# EAGLE design Blinds Motor ESP32 w endstops (EAGLE 9.6.2)
AUTHOR: E. Anderson; REV: 1
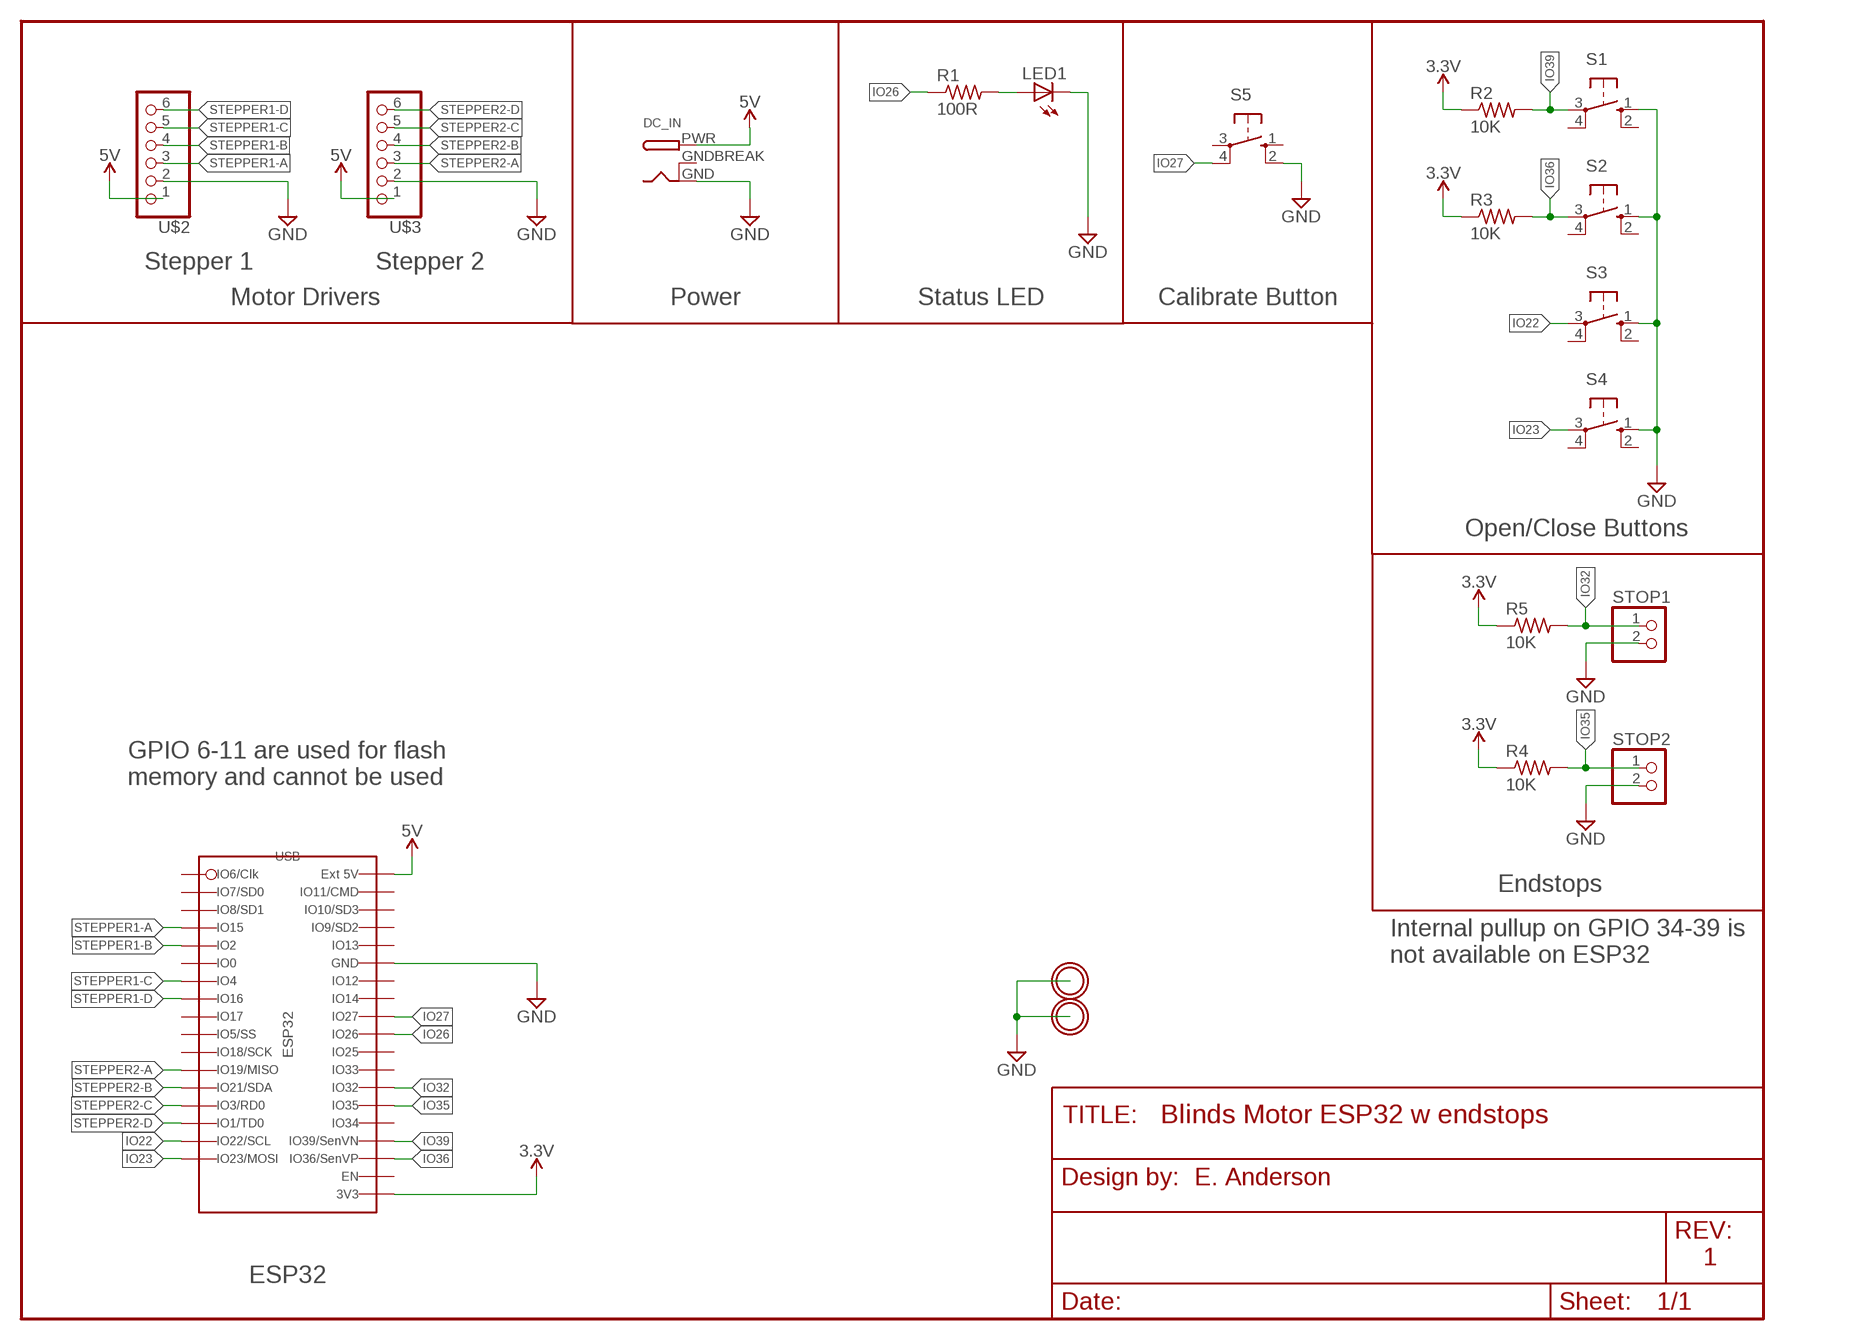
[diagram p0: schematic, sheet 1]

## Parts
DC_IN  DCBARRELPTH  [DCJACK_2MM_PTH]
LED1  LED-CHIPLED_1206_LONG  [CHIPLED_1206_LONG]
R1  100R  R_USR1206  [R1206]
R2  10K  R_USR1206  [R1206]
R3  10K  R_USR1206  [R1206]
R4  10K  R_USR1206  [R1206]
R5  10K  R_USR1206  [R1206]
S1  B3F-10XX  [B3F-10XX]
S2  B3F-10XX  [B3F-10XX]
S3  B3F-10XX  [B3F-10XX]
S4  B3F-10XX  [B3F-10XX]
S5  B3F-10XX  [B3F-10XX]
STOP1  1X2_HEADER_LONG  [1X02]
STOP2  1X2_HEADER_LONG  [1X02]
U$2  Stepper 1  1X6_HEADER_LONG  [1X06]
U$3  Stepper 2  1X6_HEADER_LONG  [1X06]
U$5  MICROBUILDER_MOUNTINGHOLE3.0THIN  [MICROBUILDER_MOUNTINGHOLE_3.0_PLATEDTHIN]
U$6  MICROBUILDER_MOUNTINGHOLE3.0THIN  [MICROBUILDER_MOUNTINGHOLE_3.0_PLATEDTHIN]
U$7  ESP32-DEV  [ESP32_DEV]

## Nets
3.3V: R2.1 R3.1 R4.1 R5.1 U$7.3V3
5V: DC_IN.PWR U$2.1 U$3.1 U$7.5V(EXT_5V)
GND: DC_IN.GND LED1.C S1.1(S) S2.1(S) S3.1(S) S4.1(S) S5.2(S1) STOP1.2 STOP2.2 U$2.2 U$3.2 U$7.GND1 U$7.GND2(GND1) U$7.GND(GND1)
IO22: S3.3(P) U$7.IO22
IO23: S4.3(P) U$7.IO23(IO23/SCL)
IO26: R1.1 U$7.IO26
IO27: S5.4(P1) U$7.IO27
IO32: R5.2 STOP1.1 U$7.IO32
IO35: R4.2 STOP2.1 U$7.IO35
IO36: R3.2 S2.3(P) U$7.IO36-SVP(IO36/SVP)
IO39: R2.2 S1.3(P) U$7.IO39-SVN(IO39/SVN)
N$1: LED1.A R1.2
STEPPER1-A: U$2.3 U$7.IO15
STEPPER1-B: U$2.4 U$7.IO2
STEPPER1-C: U$2.5 U$7.IO4
STEPPER1-D: U$2.6 U$7.IO16
STEPPER2-A: U$3.3 U$7.IO19
STEPPER2-B: U$3.4 U$7.IO21(IO21/SDA)
STEPPER2-C: U$3.5 U$7.IO3-RXD0(RXD0)
STEPPER2-D: U$3.6 U$7.IO1-TXD0(TXD0)
Unconnected: S1.2(S1) S1.4(P1) S2.2(S1) S2.4(P1) S3.2(S1) S3.4(P1) S4.2(S1) S4.4(P1) S5.1(S) S5.3(P) U$7.EN U$7.IO0 U$7.IO5 U$7.IO6-CLK(CLK) U$7.IO7-SD0(SD0) U$7.IO8-SD1(SD1) U$7.IO9-SD2(IO9/SD2) U$7.IO10-SD3(IO10/SD3) U$7.IO11-CMD(IO11/CMD) U$7.IO12 U$7.IO13 U$7.IO14 U$7.IO17 U$7.IO18 U$7.IO25 U$7.IO33 U$7.IO34

## Notes on the sheet
- Stepper 1 | Stepper 2
- Motor Drivers | Power | Status LED | Calibrate Button
- Open/Close Buttons
- GPIO 6-11 are used for flash
  memory and cannot be used
- Endstops
- Internal pullup on GPIO 34-39 is
  not available on ESP32
- ESP32

## Power pins joined to a net without a drawn wire
GNDBREAK: DC_IN.GNDBREAK

## Library data of the parts
DC_IN = connectors:DCBARREL: 2.0mm DC Barrel Jack DCJACK_2MM_PTH - Through Hole Jack (4UConnector: 05537)
LED1 = Transistors MOSFETs:LED: LED White LED 0.1" pitch
R1-R5 = passives:R_US: Resistor 7mm pin spacing
S1-S5 = buttons:B3F-10XX: OMRON SWITCH; MPN: B3F-1000; OC_FARNELL: 176432; OC_NEWARK: 36M3542
STOP1 STOP2 = connectors:1X2_HEADER: 1x2 Pin Header w/ 0.1" spacing. Octagonal pads
U$2 U$3 = connectors:1X6_HEADER: 1x6 Pin Header w/ 0.1" spacing. Octagonal pads
U$5 U$6 = connectors:MICROBUILDER_MOUNTINGHOLE: Mounting Hole For #2 screws (0.086"/2.18mm width, 0.094"/2.4mm hole) use 2.5mm; BOM: EXCLUDE
U$7 = connectors:ESP32: ESP-32-Dev ESP32 from Inland/Microcenter

## Board
Blind stepper motor board with endstops Board for connecting ESP32 to stepper drivers. Uses ESP32-Dev board or the Inland clone sold at Microcenter. Could be modified to use other ESP32 based developer boards, but code would need to be modified to use different pinouts. Uses Keyestudio Stepper ULN2003 based driver
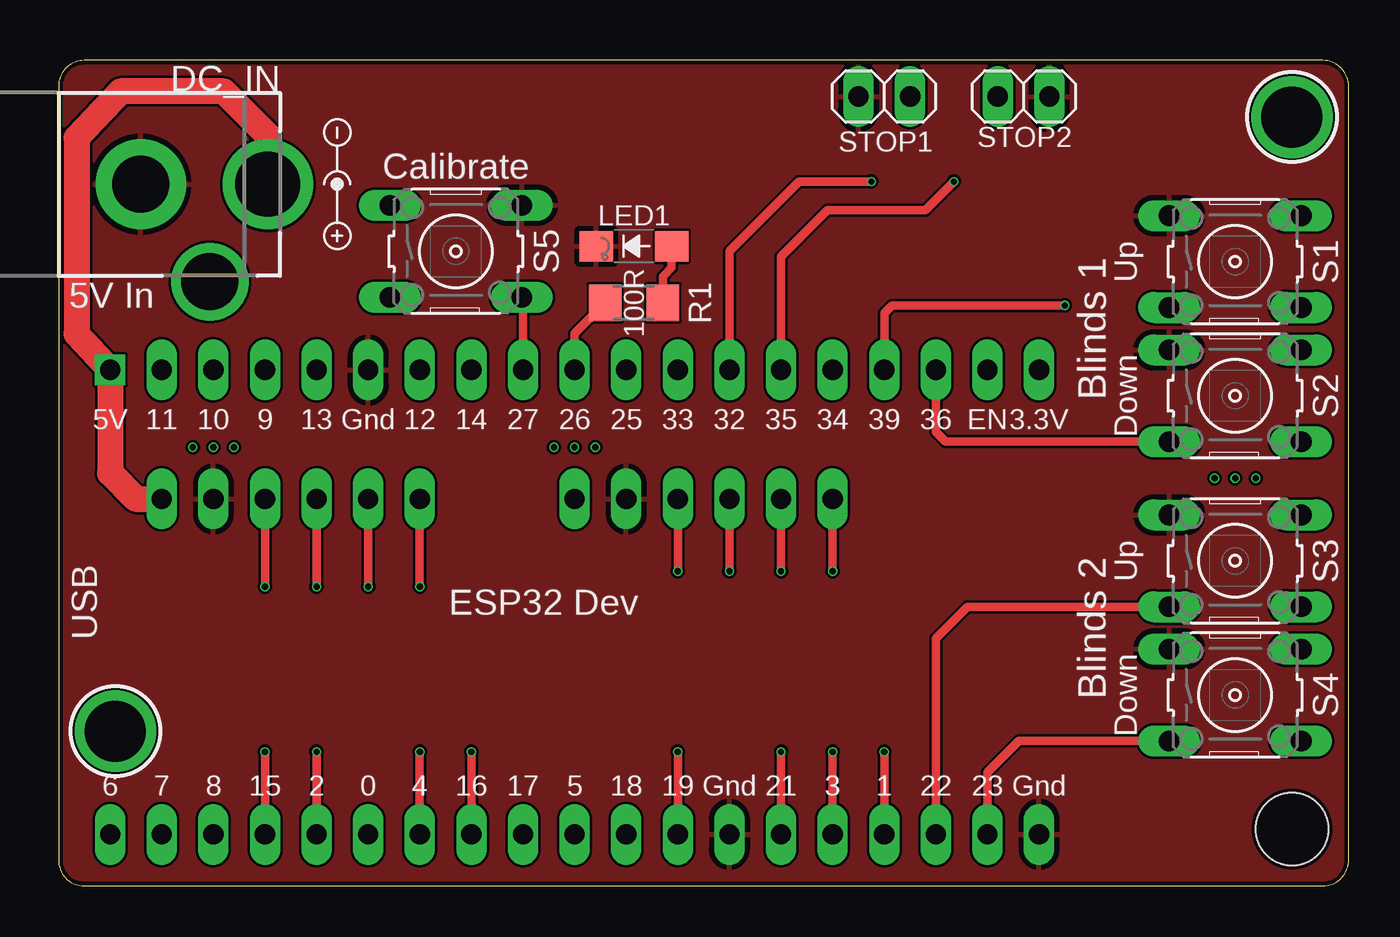
[diagram p1: board, top side]
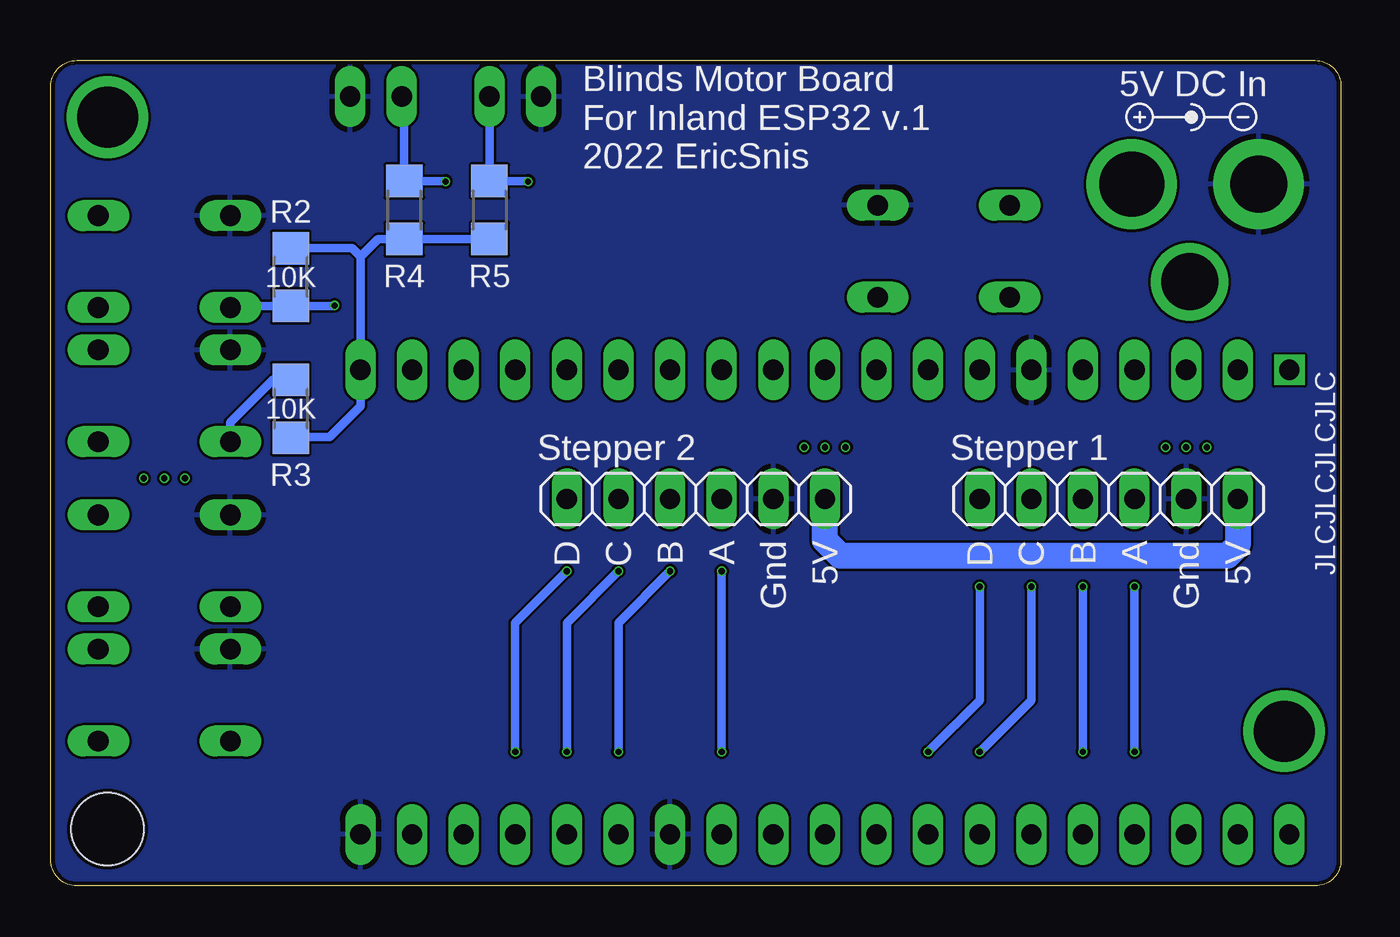
[diagram p2: board, bottom side, seen from below]

Size 63.5 x 40.64 mm. Coordinates in mm from the lower left corner, seen from the top.
Outline: 1.27,0 62.23,0 arc90 63.5,1.27 63.5,39.37 arc90 62.23,40.64 1.27,40.64 arc90 0,39.37 0,1.27 arc90 1.27,0
Copper layers (1*16): Top 0.035559375mm / dielectric 1.6mm / Bottom 0.035559375mm
Design rules "default": minimum track width 5mil, minimum drill 12mil, track to track 5mil, track to pad 5mil, pad to pad 5mil, via to via 5mil, smd to smd 5mil, copper to edge 8mil, drill to drill 6mil, minimum pad ring 5mil, minimum via ring 3mil, stop-mask expansion 2.5mil, vias tented up to drill 0mil, thermal gap 10mil
Holes 3.56 mm at 60.71,2.79

### Footprints (pad centres in the part's own frame; a part is rotated, then mirrored left to right if it is on the bottom)
DCJACK_2MM_PTH = drill 2.8 pad 4.445: GND 0,7.35 | drill 2.8: GNDBREAK 4.8,10.75 | drill 3.2 pad 4.445: PWR 0,13.6
CHIPLED_1206_LONG = smd 1.5 x 1.651: A 0,-1.854; C 0,1.854
R1206 = smd 1.6 x 1.803: 1 -1.422,0; 2 1.422,0
B3F-10XX = drill 1.016 long: 1 -3.251,2.261; 2 3.251,2.261; 3 -3.251,-2.261; 4 3.251,-2.261
1X02 = drill 1 long: 1 -1.27,0; 2 1.27,0
1X06 = drill 1 long: 1 -6.35,0; 2 -3.81,0; 3 -1.27,0; 4 1.27,0; 5 3.81,0; 6 6.35,0
MICROBUILDER_MOUNTINGHOLE_3.0_PLATEDTHIN = drill 3 pad 3.6: P$1 0,0
ESP32_DEV = drill 1 long: 3V3 11.43,-22.86; EN 11.43,-20.32; GND 11.43,10.16; GND1 -11.43,-22.86; GND2 -11.43,-7.62; IO0 -11.43,10.16; IO1-TXD0 -11.43,-15.24; IO2 -11.43,12.7; IO3-RXD0 -11.43,-12.7; IO4 -11.43,7.62; IO5 -11.43,0; IO6-CLK -11.43,22.86; IO7-SD0 -11.43,20.32; IO8-SD1 -11.43,17.78; IO9-SD2 11.43,15.24; IO10-SD3 11.43,17.78; IO11-CMD 11.43,20.32; IO12 11.43,7.62; IO13 11.43,12.7; IO14 11.43,5.08; IO15 -11.43,15.24; IO16 -11.43,5.08; IO17 -11.43,2.54; IO18 -11.43,-2.54; IO19 -11.43,-5.08; IO21 -11.43,-10.16; IO22 -11.43,-17.78; IO23 -11.43,-20.32; IO25 11.43,-2.54; IO26 11.43,0; IO27 11.43,2.54; IO32 11.43,-7.62; IO33 11.43,-5.08; IO34 11.43,-12.7; IO35 11.43,-10.16; IO36-SVP 11.43,-17.78; IO39-SVN 11.43,-15.24 | drill 1 square: 5V 11.43,22.86

### Placement (x,y rotation side)
DC_IN  -3.3,34.54 270 top
LED1  28.32,31.5 90 top
R1  28.32,28.7 0 top
R2  51.69,29.97 270 bottom
R3  51.69,23.5 90 bottom
R4  46.1,33.27 90 bottom
R5  41.91,33.27 90 bottom
S1  57.91,30.73 0 top
S2  57.91,24.13 0 top
S3  57.91,16 0 top
S4  57.91,9.4 0 top
S5  19.56,31.24 0 top
STOP1  40.64,38.86 180 top
STOP2  47.5,38.86 0 top
U$2  11.43,19.05 180 bottom
U$3  31.75,19.05 180 bottom
U$4  [CENTER-POS-SMALL]  13.72,34.54 90 top
U$5  2.79,7.62 0 top
U$6  60.71,37.85 0 top
U$7  25.4,13.97 90 top
U$8  [CENTER-POS-SMALL]  7.37,37.85 0 bottom

### Tracks (layer width: path | path; a pad name or v marks a point on that pad's centre or on a via)
3.3V
  Bottom 0.406: R3.1 51.66,22.1 49.78,22.1 48.26,23.62 U$7.3V3 48.26,30.99 | R2.1 48.67,31.39 48.26,30.99 | R5.1 R4.1 47.4,31.85 48.26,30.99
5V
  Top 1.27: DC_IN.PWR 10.3,36.95 8.13,39.12 3.05,39.12 0.89,36.83 0.89,27.18 U$7.5V 2.54,20.32 3.81,19.05 U$2.1
  Bottom 1.27: U$2.1 5.08,16.76 5.59,16.26 24.64,16.26 25.4,17.02 U$3.1
GND
  pour Top (isolate 0.001): 1.27,0 62.23,0 arc90 63.5,1.27 63.5,39.37 arc90 62.23,40.64 1.27,40.64 arc90 0,39.37 0,1.27 arc90
  pour Bottom (isolate 0.001): 1.27,0 62.23,0 arc90 63.5,1.27 63.5,39.37 arc90 62.23,40.64 1.27,40.64 arc90 0,39.37 0,1.27 arc90
IO22
  Top 0.406: S3.3 44.73,13.74 43.18,12.19 U$7.IO22
IO23
  Top 0.406: S4.3 47.27,7.14 45.72,5.59 U$7.IO23
IO26
  Top 0.406: U$7.IO26 25.4,27.2 R1.1
IO27
  Top 0.406: U$7.IO27 22.86,28.93 S5.4
IO32  (via drill 0.3)
  Top 0.406: v40.01,34.67 36.45,34.67 33.02,31.24 U$7.IO32
  Bottom 0.406: STOP1.1 R5.2 40.03,34.7 v40.01,34.67
IO35  (via drill 0.3)
  Top 0.406: v44.07,34.67 42.67,33.27 37.85,33.27 35.56,30.99 U$7.IO35
  Bottom 0.406: STOP2.1 46.1,38.73 R4.2 44.09,34.7 v44.07,34.67
IO36
  Top 0.406: S2.3 43.66,21.87 43.18,22.35 U$7.IO36-SVP
  Bottom 0.406: S2.3 54.66,22.81 52.55,24.92 R3.2
IO39  (via drill 0.3)
  Top 0.406: v49.53,28.57 41.02,28.57 40.64,28.19 U$7.IO39-SVN
  Bottom 0.406: 51.77,28.47 R2.2 | R2.2 54.58,28.55 S1.3 | R2.2 49.55,28.55 v49.53,28.57
N$1
  Top 0.406: R1.2 29.74,30 30.18,30.43 LED1.A
N$2  (via drill 0.3)
  other vias: 8.64,21.59
N$3  (via drill 0.3)
  other vias: 7.62,21.59
N$4  (via drill 0.3)
  other vias: 6.6,21.59
N$5  (via drill 0.3)
  other vias: 26.42,21.59
N$6  (via drill 0.3)
  other vias: 25.4,21.59
N$7  (via drill 0.3)
  other vias: 24.38,21.59
N$9  (via drill 0.3)
  other vias: 58.93,20.07
N$10  (via drill 0.3)
  other vias: 57.91,20.07
N$11  (via drill 0.3)
  other vias: 56.9,20.07
STEPPER1-A  (via drill 0.3)
  Top 0.406: U$2.3 v10.16,14.73 | U$7.IO15 v10.16,6.6
  Bottom 0.406: v10.16,14.73 v10.16,6.6
STEPPER1-B  (via drill 0.3)
  Top 0.406: U$2.4 v12.7,14.73 | U$7.IO2 v12.7,6.6
  Bottom 0.406: v12.7,14.73 v12.7,6.6
STEPPER1-C  (via drill 0.3)
  Top 0.406: U$2.5 v15.24,14.73 | U$7.IO4 v17.78,6.6
  Bottom 0.406: v15.24,14.73 15.24,9.14 v17.78,6.6
STEPPER1-D  (via drill 0.3)
  Top 0.406: U$2.6 v17.78,14.73 | U$7.IO16 v20.32,6.6
  Bottom 0.406: v17.78,14.73 17.78,9.14 v20.32,6.6
STEPPER2-A  (via drill 0.3)
  Top 0.406: U$7.IO19 v30.48,6.6 | U$3.3 v30.48,15.49
  Bottom 0.406: v30.48,6.6 v30.48,15.49
STEPPER2-B  (via drill 0.3)
  Top 0.406: U$7.IO21 v35.56,6.6 | U$3.4 v33.02,15.49
  Bottom 0.406: v33.02,15.49 35.56,12.95 v35.56,6.6
STEPPER2-C  (via drill 0.3)
  Top 0.406: U$7.IO3-RXD0 v38.1,6.6 | U$3.5 v35.56,15.49
  Bottom 0.406: v35.56,15.49 38.1,12.95 v38.1,6.6
STEPPER2-D  (via drill 0.3)
  Top 0.406: U$7.IO1-TXD0 v40.64,6.6 | U$3.6 v38.1,15.49
  Bottom 0.406: v38.1,15.49 40.64,12.95 v40.64,6.6

### Text on the board
tPlace: Calibrate | Up | 5V In | Blinds 1 | Down | Up | USB | ESP32 Dev | Blinds 2 | Down
bPlace: 5V DC In | Blinds Motor Board / For Inland ESP32 v.1 / 2022 EricSnis | JLCJLCJLCJLC | 5V | Gnd | A | B | C | D | 5V | Gnd | A | B | C | D